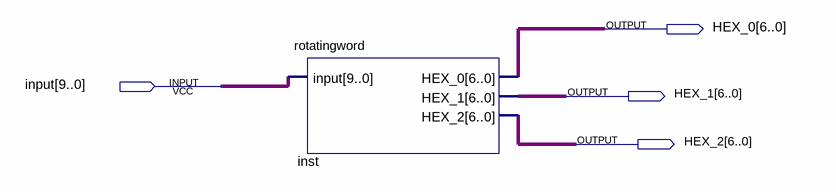
[diagram p0: schematic sheet]
// Quartus schematic Lab3B.bdf as structural Verilog: 1 symbols, 4 pins
module Lab3B (
  input  [9:0] \input ,
  output [6:0] HEX_0,
  output [6:0] HEX_1,
  output [6:0] HEX_2
);

  rotatingword inst (.\input (\input ), .HEX_0(HEX_0), .HEX_1(HEX_1), .HEX_2(HEX_2));
endmodule
